# EAGLE schematic H19R00 (EAGLE 9.6.2)

## Sheet 1 of 3: I/O parts
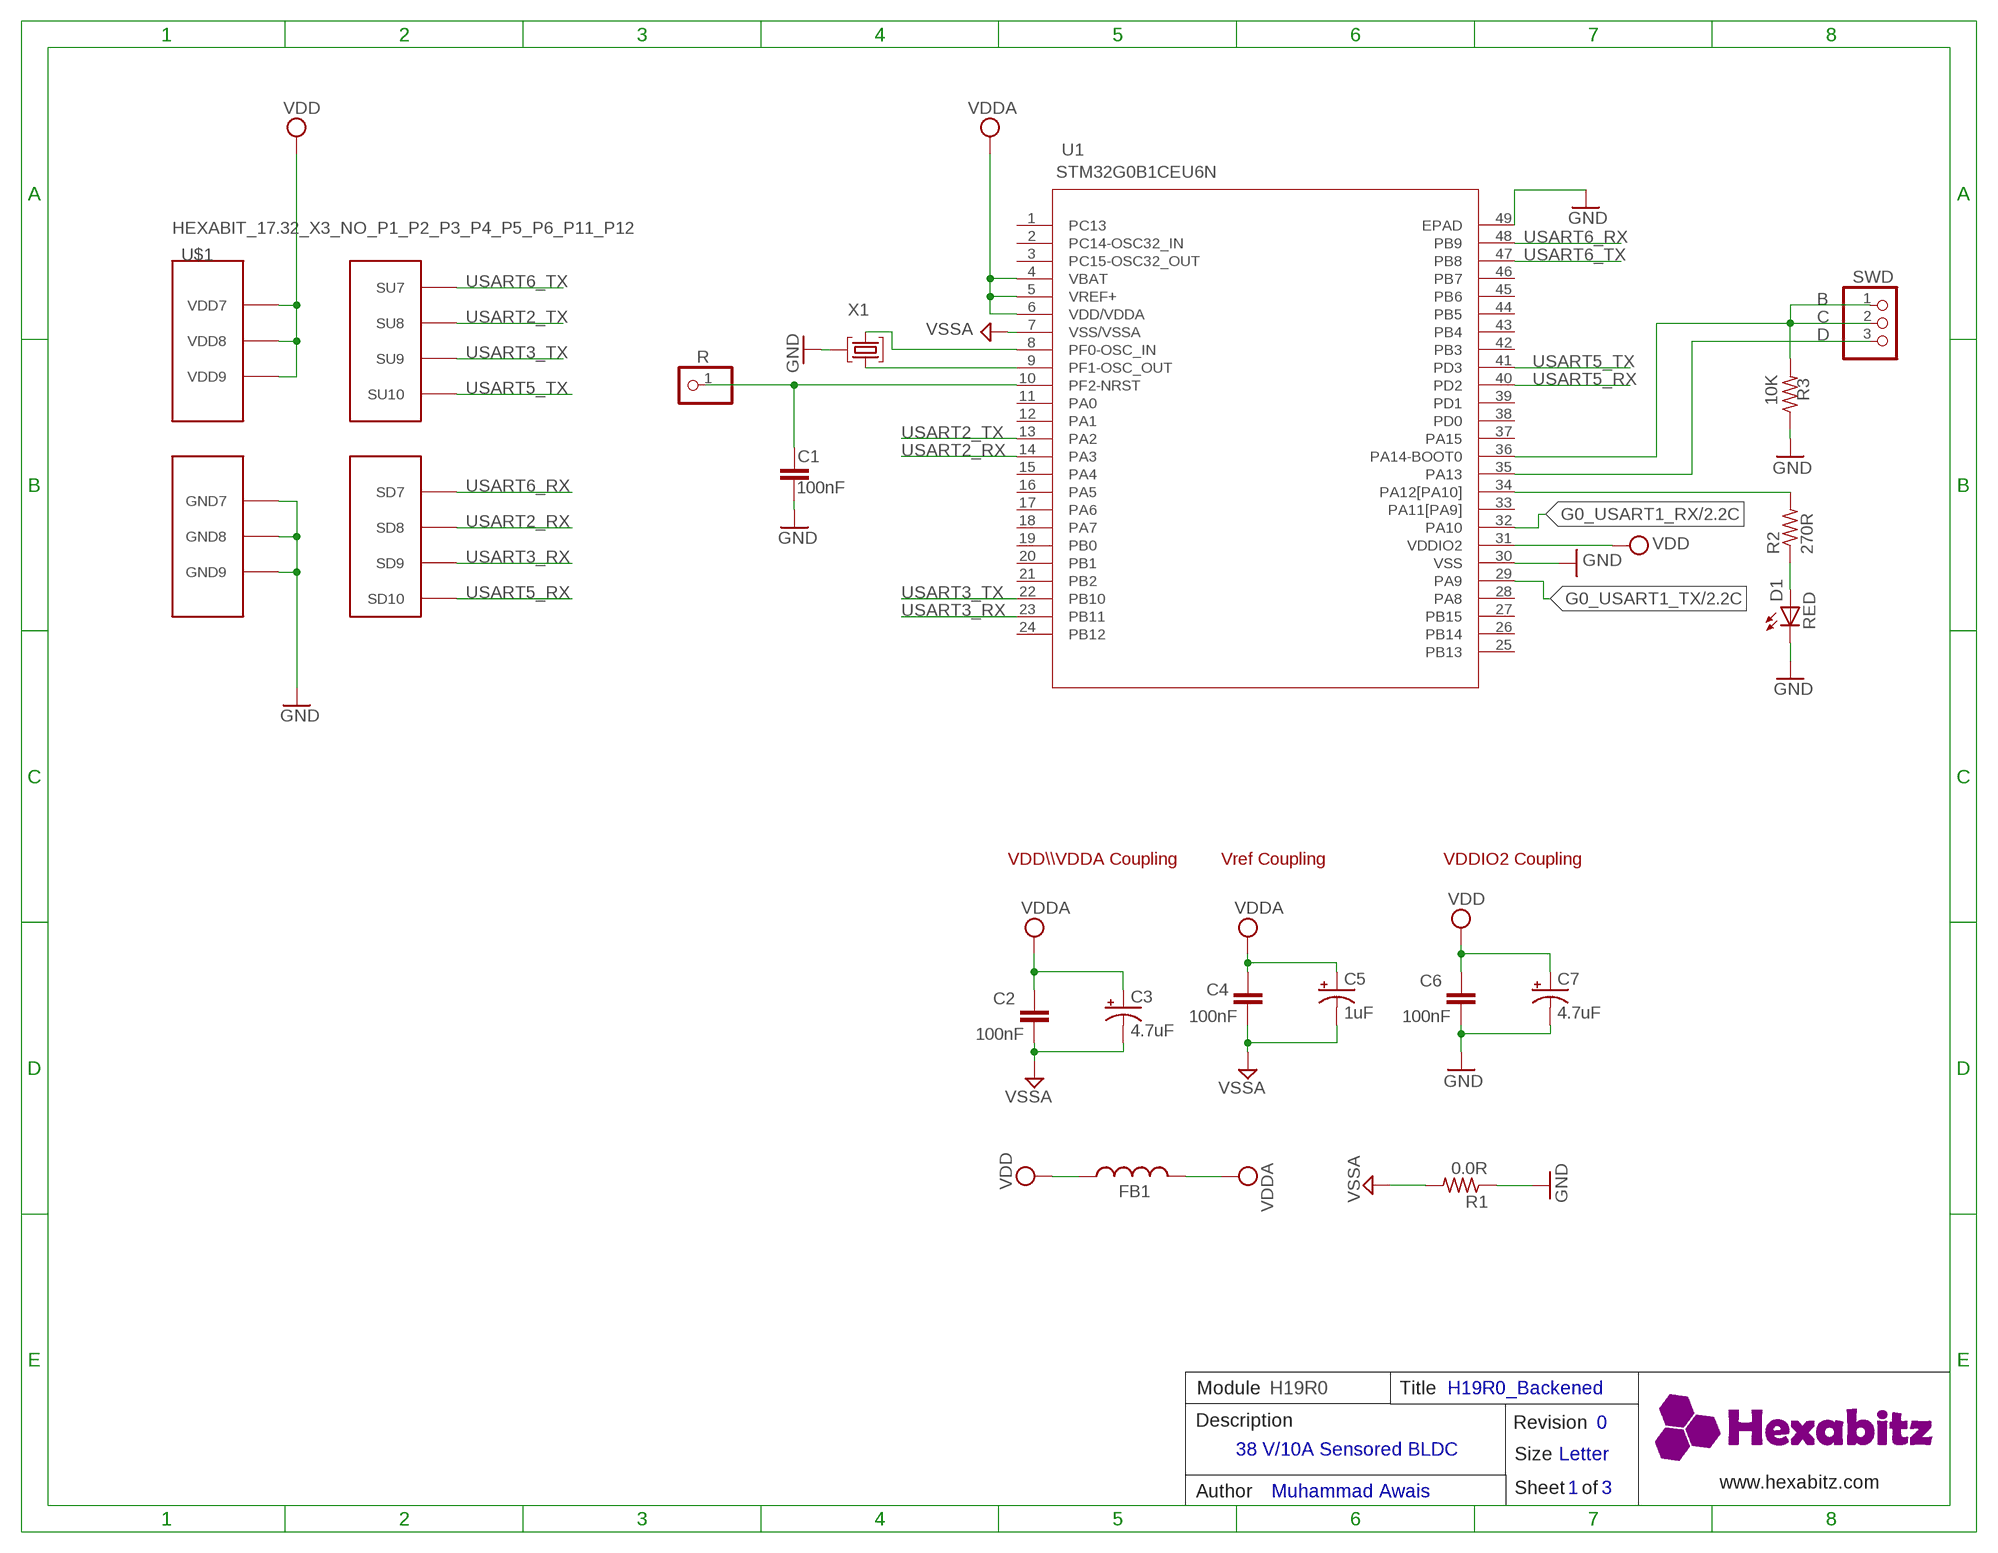
[diagram p0: schematic, sheet 1]

### Parts
C1  100nF  C-0603  [C-0603]
C2  100nF  C-0603  [C-0603]
C3  4.7uF  C-0805-POL  [C-0805-POL]
C4  100nF  C-0603  [C-0603]
C5  1uF  C-0805-POL  [C-0805-POL]
C6  100nF  C-0603  [C-0603]
C7  4.7uF  C-0805-POL  [C-0805-POL]
D1  RED  VLMS1300-GS08  [VLMS1300-GS08]
FB1  FB-TDK_MMZ1608Y300B  [FB-TDK_MMZ1608Y300B]
R  PINHD-1X1  [1X01]
R1  0.0R  R-0603  [R-0603]
R2  270R  R-0603  [R-0603]
R3  10K  R-0603  [R-0603]
SWD  PINHD-1X3  [1X03]
U1  STM32G0B1CEU6N  [HEXABITZ_ICS_QFN_B1CEU6_STM-L]
U$1  HEXABIT_17.32_X3_NO_P1_P2_P3_P4_P5_P6_P11_P12  [HEXABIT_17.32_X3_NO_P1_P2_P3_P4_P5_P6_P11_P12]
X1  8MHZ  XTALL_CSTCE8M00G52  [XTALL_CSTCE8M00G52]

### Nets
C: R3.2 SWD.1 SWD.2 U1.36(PA14-BOOT0)
D: SWD.3 U1.35(PA13)
G0_USART1_RX: U1.32(PA10) ; also sheet 2
G0_USART1_TX: U1.29(PA9) ; also sheet 2
GND: C1.1 C6.1 C7.2(-) D1.C R1.1 R3.1 U1.30(VSS) U1.49(EPAD) U$1.PAD_PD12(GND7) U$1.PAD_PD17(GND8) U$1.PAD_PD19(GND9) X1.P$2
GND1: C2.1 C3.2(-) C4.1 C5.2(-) R1.2 U1.7(VSS/VSSA) ; supply symbol labelled VSSA ; also sheet 2,3
N$1: U1.8(PF0-OSC_IN) X1.P$1
N$2: U1.9(PF1-OSC_OUT) X1.P$3
N$3: R2.2 U1.34(PA12[PA10])
N$4: D1.A R2.1
N$12: C1.2 R.1 U1.10(PF2-NRST)
USART2_RX: U1.14(PA3) U$1.PAD_PD1(SD8)
USART2_TX: U1.13(PA2) U$1.PAD_PU1(SU8)
USART3_RX: U1.23(PB11) U$1.PAD_PD2(SD9)
USART3_TX: U1.22(PB10) U$1.PAD_PU2(SU9)
USART5_RX: U1.40(PD2) U$1.PAD_PD8(SD10)
USART5_TX: U1.41(PD3) U$1.PAD_PU8(SU10)
USART6_RX: U1.48(PB9) U$1.PAD_PD3(SD7)
USART6_TX: U1.47(PB8) U$1.PAD_PU3(SU7)
VDD: C6.2 C7.1(+) FB1.1 U1.31(VDDIO2) U$1.PAD_PU12(VDD7) U$1.PAD_PU17(VDD8) U$1.PAD_PU19(VDD9) ; also sheet 2
VDDA: C2.2 C3.1(+) C4.2 C5.1(+) FB1.2 U1.4(VBAT) U1.5(VREF+) U1.6(VDD/VDDA)
Unconnected: U1.1(PC13) U1.2(PC14-OSC32_IN) U1.3(PC15-OSC32_OUT) U1.11(PA0) U1.12(PA1) U1.15(PA4) U1.16(PA5) U1.17(PA6) U1.18(PA7) U1.19(PB0) U1.20(PB1) U1.21(PB2) U1.24(PB12) U1.25(PB13) U1.26(PB14) U1.27(PB15) U1.28(PA8) U1.33(PA11[PA9]) U1.37(PA15) U1.38(PD0) U1.39(PD1) U1.42(PB3) U1.43(PB4) U1.44(PB5) U1.45(PB6) U1.46(PB7)

### Notes on the sheet
- B
- VDD\\\VDDA Coupling | Vref Coupling | VDDIO2 Coupling
- Module | H19R0 | Title | H19R0_Backened
- Description | Revision | 0
- 38 V/10A Sensored BLDC
- Size | Letter
- www.hexabitz.com
- Author | Muhammad Awais | Sheet   of | 1 | 3

## Sheet 2 of 3
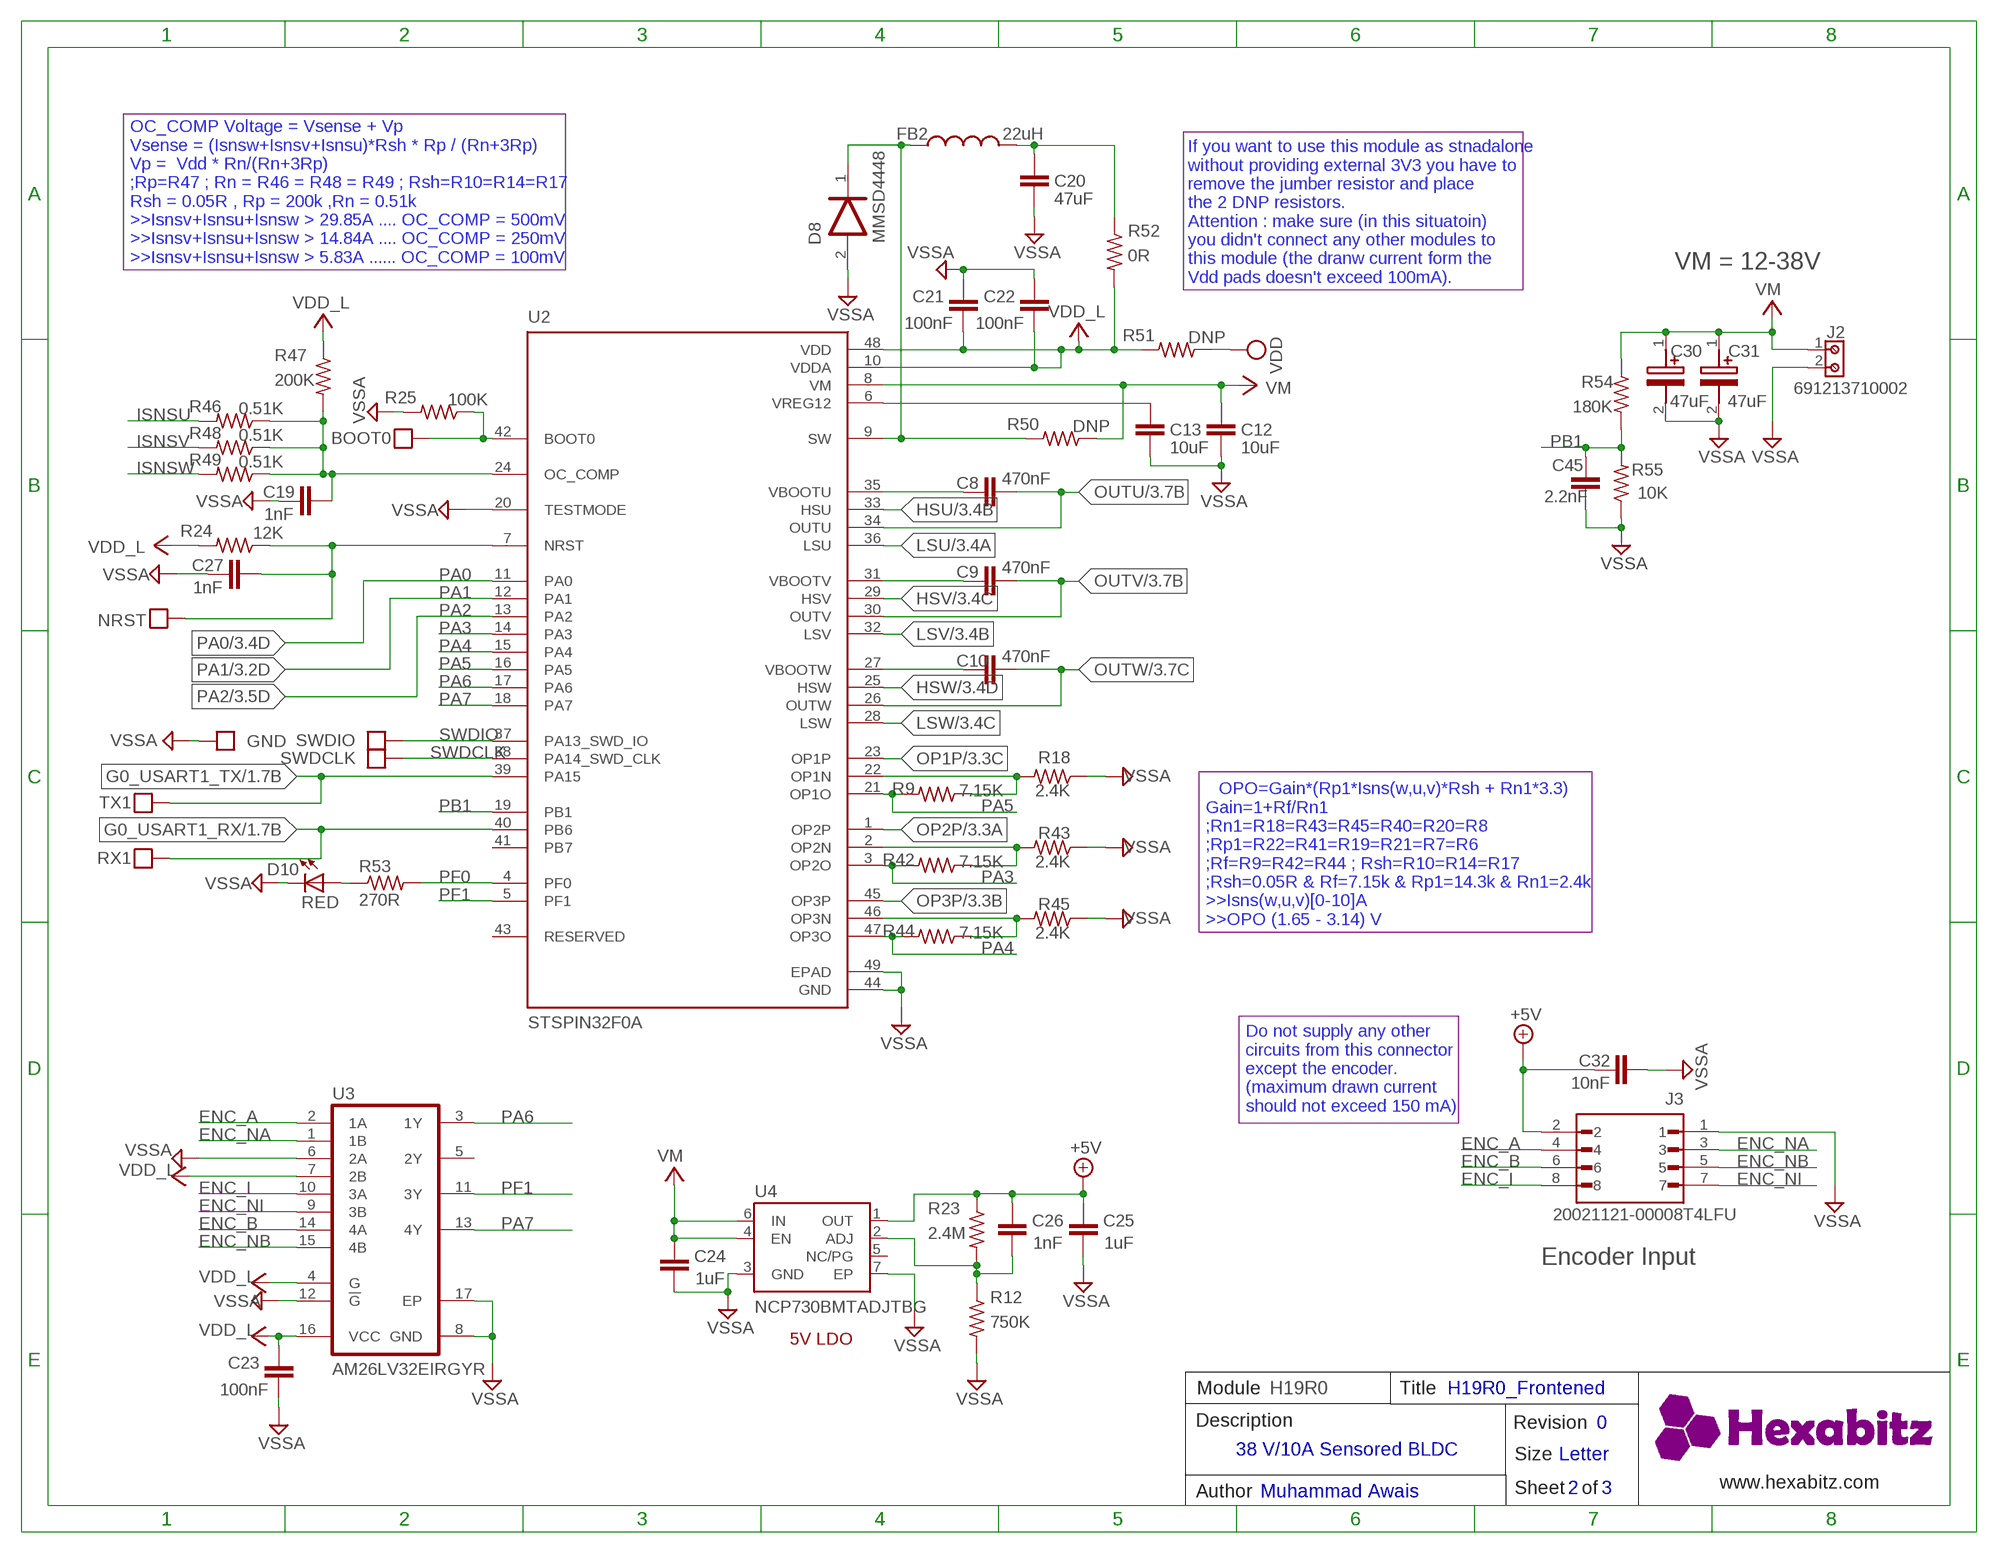
[diagram p1: schematic, sheet 2]

### Parts
BOOT0  PAD4  [PAD4]
C8  470nF  C-0603  [C-0603]
C9  470nF  C-0603  [C-0603]
C10  470nF  C-0603  [C-0603]
C12  10uF  C-0805  [C-0805]
C13  10uF  C-0805  [C-0805]
C19  1nF  C-0603  [C-0603]
C20  47uF  C-0805  [C-0805]
C21  100nF  C-0603  [C-0603]
C22  100nF  C-0603  [C-0603]
C23  100nF  C-0603  [C-0603]
C24  1uF  C-0603  [C-0603]
C25  1uF  C-0603  [C-0603]
C26  1nF  C-0603  [C-0603]
C27  1nF  C-0603  [C-0603]
C30  47uF  UVR1H101MPD1TD  [CAPPRD350W60D825H1300]
C31  47uF  UVR1H101MPD1TD  [CAPPRD350W60D825H1300]
C32  10nF  C-0603  [C-0603]
C45  2.2nF  C-0603  [C-0603]
D8  MMSD4448ONSEMI_MMSD4448_0_0  [ONSEMI_MMSD4448_0]
D10  RED  VLMS1300-GS08  [VLMS1300-GS08]
FB2  22uH  FB-0805  [FB-0805]
GND  PAD4  [PAD4]
J2  691213710002  [691213710002]
J3  20021121-00008T4LFU  [AMPHENOL_20021121-00008T4LF]
NRST  PAD4  [PAD4]
R9  7.15K  R-0603  [R-0603]
R12  750K  R-0603  [R-0603]
R18  2.4K  R-0603  [R-0603]
R23  2.4M  R-0603  [R-0603]
R24  12K  R-0603  [R-0603]
R25  100K  R-0603  [R-0603]
R42  7.15K  R-0603  [R-0603]
R43  2.4K  R-0603  [R-0603]
R44  7.15K  R-0603  [R-0603]
R45  2.4K  R-0603  [R-0603]
R46  0.51K  R-0603  [R-0603]
R47  200K  R-0603  [R-0603]
R48  0.51K  R-0603  [R-0603]
R49  0.51K  R-0603  [R-0603]
R50  DNP  R-0603  [R-0603]
R51  DNP  R-0603  [R-0603]
R52  0R  R-0603  [R-0603]
R53  270R  R-0603  [R-0603]
R54  180K  R-0603  [R-0603]
R55  10K  R-0603  [R-0603]
RX1  PAD4  [PAD4]
SWDCLK  PAD4  [PAD4]
SWDIO  PAD4  [PAD4]
TX1  PAD4  [PAD4]
U2  STSPIN32F0A  [IC_STSPIN32F0A]
U3  AM26LV32EIRGYRTEXAS_INSTRUMENTS_AM26LV32EIRGYR_0_0  [TEXAS_INSTRUMENTS_AM26LV32EIRGYR_0]
U4  NCP730BMTADJTBGON_SEMI_NCP730BMTADJTBG_0_0  [ON_SEMI_NCP730BMTADJTBG_0]

### Nets
+5V: C25.2 C26.2 C32.1 J3.2 R23.1 U4.1(OUT) ; also sheet 3
ENC_A: J3.4 U3.2(1A)
ENC_B: J3.6 U3.14(4A)
ENC_I: J3.8 U3.10(3A)
ENC_NA: J3.3 U3.1(1B)
ENC_NB: J3.5 U3.15(4B)
ENC_NI: J3.7 U3.9(3B)
G0_USART1_RX: RX1.P$1 U2.40(PB6) ; also sheet 1
G0_USART1_TX: TX1.P$1 U2.39(PA15) ; also sheet 1
GND1: C12.2 C13.2 C19.1 C20.2 C21.2 C22.2 C23.1 C24.1 C25.1 C27.1 C30.2(-) C31.2(-) C32.2 C45.1 D8.2(ANODE) D10.C GND.P$1 J2.2 J3.1 R12.2 R18.1 R25.2 R43.1 R45.1 R55.1 U2.20(TESTMODE) U2.44(GND) U2.49(EPAD) U3.8(GND) U3.12(!G!) U3.17(EP) U4.3(GND) U4.7(EP) ; supply symbol labelled VSSA ; also sheet 1,3
HSU: U2.33(HSU) ; also sheet 3
HSV: U2.29(HSV) ; also sheet 3
HSW: U2.25(HSW) ; also sheet 3
ISNSU: R46.2 ; also sheet 3
ISNSV: R48.2 ; also sheet 3
ISNSW: R49.2 ; also sheet 3
LSU: U2.36(LSU) ; also sheet 3
LSV: U2.32(LSV) ; also sheet 3
LSW: U2.28(LSW) ; also sheet 3
N$5: R42.1 R43.2 U2.2(OP2N)
N$6: C8.2 U2.35(VBOOTU)
N$7: C9.2 U2.31(VBOOTV)
N$8: C10.2 U2.27(VBOOTW)
N$11: C26.1 R12.1 R23.2 U4.2(ADJ)
N$14: C27.2 NRST.P$1 R24.1 U2.7(NRST)
N$15: C13.1 U2.6(VREG12)
N$17: BOOT0.P$1 R25.1 U2.42(BOOT0)
N$18: U3.6(2A) ; supply symbol labelled VSSA
N$29: R9.1 R18.2 U2.22(OP1N)
N$30: R44.1 R45.2 U2.46(OP3N)
N$31: C19.2 R46.1 R47.2 R48.1 R49.1 U2.24(OC_COMP)
N$32: D10.A R53.1
N$33: D8.1(CATHODE) FB2.1 R50.2 U2.9(SW)
N$34: C20.1 FB2.2 R52.1
OP1P: U2.23(OP1P) ; also sheet 3
OP2P: U2.1(OP2P) ; also sheet 3
OP3P: U2.45(OP3P) ; also sheet 3
OUTU: C8.1 U2.34(OUTU) ; also sheet 3
OUTV: C9.1 U2.30(OUTV) ; also sheet 3
OUTW: C10.1 U2.26(OUTW) ; also sheet 3
PA0: U2.11(PA0) ; also sheet 3
PA1: U2.12(PA1) ; also sheet 3
PA2: U2.13(PA2) ; also sheet 3
PA3: R42.2 U2.3(OP2O) U2.14(PA3)
PA4: R44.2 U2.15(PA4) U2.47(OP3O)
PA5: R9.2 U2.16(PA5) U2.21(OP1O)
PA6: U2.17(PA6) U3.3(1Y)
PA7: U2.18(PA7) U3.13(4Y)
PB1: C45.2 R54.2 R55.2 U2.19(PB1)
PF0: R53.2 U2.4(PF0)
PF1: U2.5(PF1) U3.11(3Y)
SWDCLK: SWDCLK.P$1 U2.38(PA14_SWD_CLK)
SWDIO: SWDIO.P$1 U2.37(PA13_SWD_IO)
VDD: R51.1 ; also sheet 1
VDD_L: C21.1 C22.1 C23.2 R24.2 R47.1 R51.2 R52.2 U2.10(VDDA) U2.48(VDD) U3.4(G) U3.7(2B) U3.16(VCC) ; also sheet 3
VM: C12.1 C24.2 C30.1(+) C31.1(+) J2.1 R50.1 R54.1 U2.8(VM) U4.4(EN) U4.6(IN) ; also sheet 3
Unconnected: U2.41(PB7) U2.43(RESERVED) U3.5(2Y) U4.5(NC/PG)

### Notes on the sheet
- OC_COMP Voltage = Vsense + Vp
  Vsense = (Isnsw+Isnsv+Isnsu)*Rsh * Rp / (Rn+3Rp) 
  Vp =  Vdd * Rn/(Rn+3Rp)
  ;Rp=R47 ; Rn = R46 = R48 = R49 ; Rsh=R10=R14=R17
  Rsh = 0.05R , Rp = 200k ,Rn = 0.51k
  >>Isnsv+Isnsu+Isnsw > 29.85A .... OC_COMP = 500mV
  >>Isnsv+Isnsu+Isnsw > 14.84A .... OC_COMP = 250mV
  >>Isnsv+Isnsu+Isnsw > 5.83A ...... OC_COMP = 100mV
- VM = 12-38V
- If you want to use this module as stnadalone
  without providing external 3V3 you have to
  remove the jumber resistor and place
  the 2 DNP resistors.
  Attention : make sure (in this situatoin)
  you didn't connect any other modules to
  this module (the dranw current form the
  Vdd pads doesn't exceed 100mA).
- ￼OPO=Gain*(Rp1*Isns(w,u,v)*Rsh + Rn1*3.3)
  Gain=1+Rf/Rn1
  ;Rn1=R18=R43=R45=R40=R20=R8
  ;Rp1=R22=R41=R19=R21=R7=R6
  ;Rf=R9=R42=R44 ; Rsh=R10=R14=R17
  ;Rsh=0.05R & Rf=7.15k & Rp1=14.3k & Rn1=2.4k
  >>Isns(w,u,v)[0-10]A 
  >>OPO (1.65 - 3.14) V
- Do not supply any other
  circuits from this connector
  except the encoder.
  (maximum drawn current
  should not exceed 150 mA)
- Encoder Input
- 5V LDO
- Module | H19R0 | Title | H19R0_Frontened
- Description | Revision | 0
- 38 V/10A Sensored BLDC
- Size | Letter
- www.hexabitz.com
- Author | Muhammad Awais | Sheet   of | 2 | 3

## Sheet 3 of 3
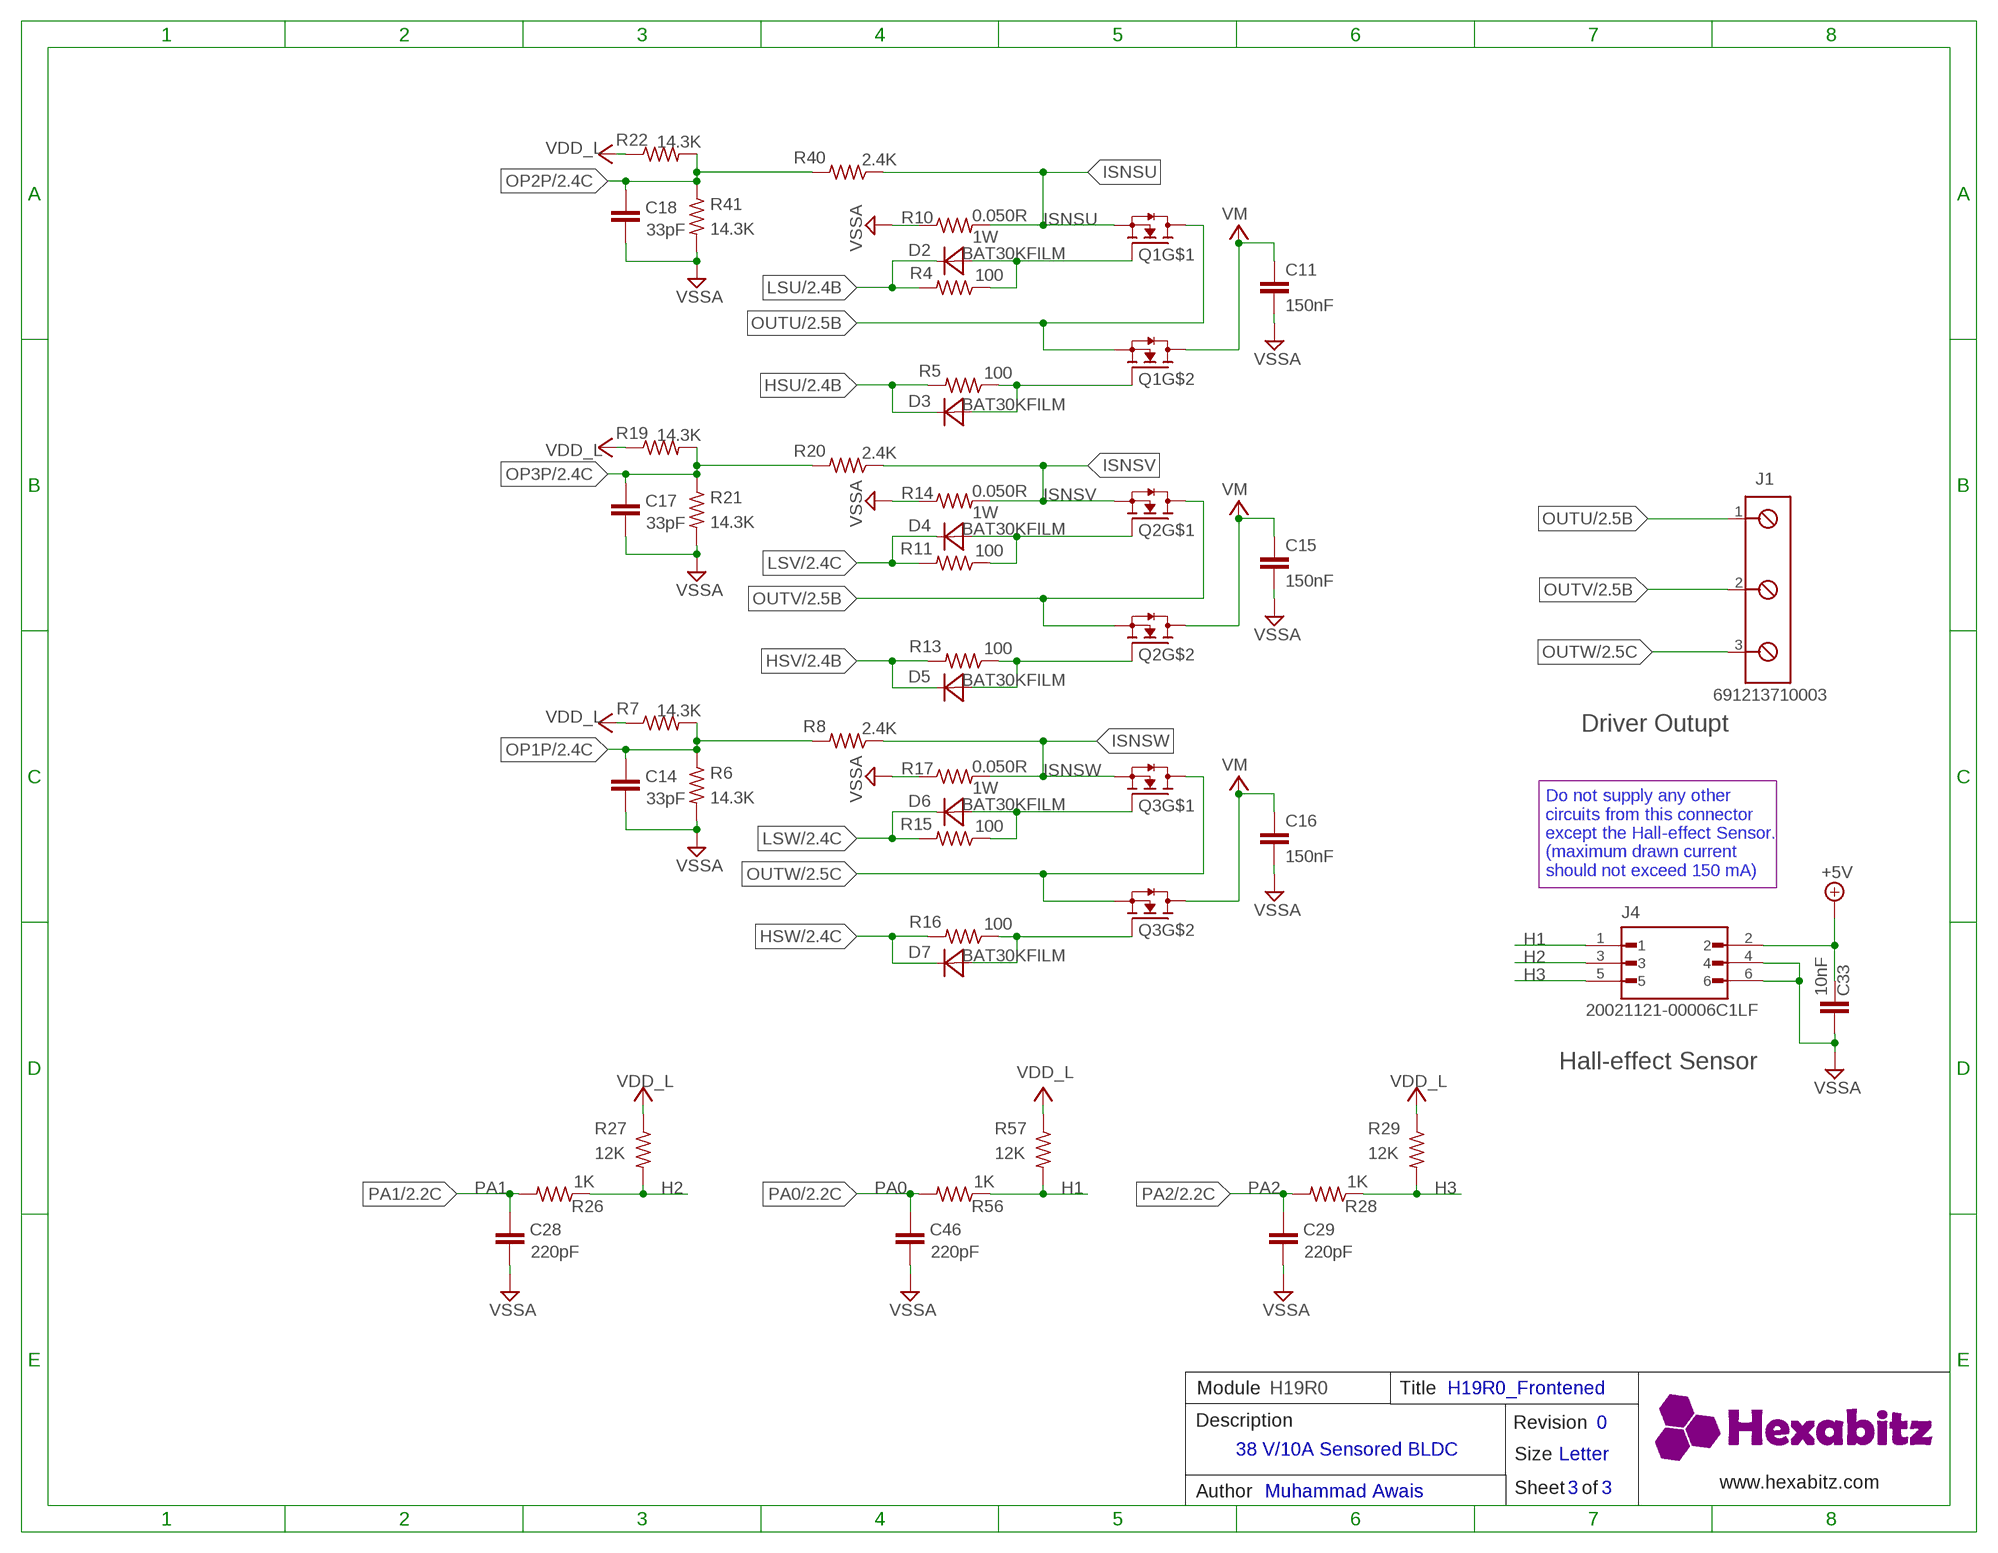
[diagram p2: schematic, sheet 3]

### Parts
C11  150nF  C-0805  [C-0805]
C14  33pF  C-0603  [C-0603]
C15  150nF  C-0805  [C-0805]
C16  150nF  C-0805  [C-0805]
C17  33pF  C-0603  [C-0603]
C18  33pF  C-0603  [C-0603]
C28  220pF  C-0603  [C-0603]
C29  220pF  C-0603  [C-0603]
C33  10nF  C-0603  [C-0603]
C46  220pF  C-0603  [C-0603]
D2  BAT30KFILM  [STMICROELECTRONICS_BAT30KFILM_0]
D3  BAT30KFILM  [STMICROELECTRONICS_BAT30KFILM_0]
D4  BAT30KFILM  [STMICROELECTRONICS_BAT30KFILM_0]
D5  BAT30KFILM  [STMICROELECTRONICS_BAT30KFILM_0]
D6  BAT30KFILM  [STMICROELECTRONICS_BAT30KFILM_0]
D7  BAT30KFILM  [STMICROELECTRONICS_BAT30KFILM_0]
J1  691213710003  691213710003  [691213710003]
J4  20021121-00006C1LF  [AMPHENOL_20021121-00006C1LF]
Q1  PJQ5866A_R2_00001  [PJQ5866A_R2_00001-8-POWERTDFN]
Q2  PJQ5866A_R2_00001  [PJQ5866A_R2_00001-8-POWERTDFN]
Q3  PJQ5866A_R2_00001  [PJQ5866A_R2_00001-8-POWERTDFN]
R4  100  R-0603  [R-0603]
R5  100  R-0603  [R-0603]
R6  14.3K  R-0603  [R-0603]
R7  14.3K  R-0603  [R-0603]
R8  2.4K  R-0603  [R-0603]
R10  0.050R  R_1206R1206  [R1206]
R11  100  R-0603  [R-0603]
R13  100  R-0603  [R-0603]
R14  0.050R  R_1206R1206  [R1206]
R15  100  R-0603  [R-0603]
R16  100  R-0603  [R-0603]
R17  0.050R  R_1206R1206  [R1206]
R19  14.3K  R-0603  [R-0603]
R20  2.4K  R-0603  [R-0603]
R21  14.3K  R-0603  [R-0603]
R22  14.3K  R-0603  [R-0603]
R26  1K  R-0603  [R-0603]
R27  12K  R-0603  [R-0603]
R28  1K  R-0603  [R-0603]
R29  12K  R-0603  [R-0603]
R40  2.4K  R-0603  [R-0603]
R41  14.3K  R-0603  [R-0603]
R56  1K  R-0603  [R-0603]
R57  12K  R-0603  [R-0603]

### Nets
+5V: C33.1 J4.2 ; also sheet 2
GND1: C11.2 C14.1 C15.2 C16.2 C17.1 C18.1 C28.1 C29.1 C33.2 C46.1 J4.4 J4.6 R6.2 R10.1 R14.1 R17.1 R21.2 R41.2 ; supply symbol labelled VSSA ; also sheet 1,2
H1: J4.1 R56.1 R57.2
H2: J4.3 R26.1 R27.2
H3: J4.5 R28.1 R29.2
HSU: D3.C R5.2 ; also sheet 2
HSV: D5.C R13.2 ; also sheet 2
HSW: D7.C R16.2 ; also sheet 2
ISNSU: Q1.1(S1) R10.2 R40.1 ; also sheet 2
ISNSV: Q2.1(S1) R14.2 R20.1 ; also sheet 2
ISNSW: Q3.1(S1) R8.1 R17.2 ; also sheet 2
LSU: D2.C R4.2 ; also sheet 2
LSV: D4.C R11.2 ; also sheet 2
LSW: D6.C R15.2 ; also sheet 2
N$9: D2.A Q1.2(G1) R4.1
N$10: D4.A Q2.2(G1) R11.1
N$13: D3.A Q1.4(G2) R5.1
N$16: D5.A Q2.4(G2) R13.1
N$26: D6.A Q3.2(G1) R15.1
N$27: D7.A Q3.4(G2) R16.1
OP1P: C14.2 R6.1 R7.2 R8.2 ; also sheet 2
OP2P: C18.2 R22.2 R40.2 R41.1 ; also sheet 2
OP3P: C17.2 R19.2 R20.2 R21.1 ; also sheet 2
OUTU: J1.1 Q1.3(S2) Q1.7_8(D1) ; also sheet 2
OUTV: J1.2 Q2.3(S2) Q2.7_8(D1) ; also sheet 2
OUTW: J1.3 Q3.3(S2) Q3.7_8(D1) ; also sheet 2
PA0: C46.2 R56.2 ; also sheet 2
PA1: C28.2 R26.2 ; also sheet 2
PA2: C29.2 R28.2 ; also sheet 2
VDD_L: R7.1 R19.1 R22.1 R27.1 R29.1 R57.1 ; also sheet 2
VM: C11.1 C15.1 C16.1 Q1.5_6(D2) Q2.5_6(D2) Q3.5_6(D2) ; also sheet 2

### Notes on the sheet
- Driver Outupt
- Do not supply any other
  circuits from this connector
  except the Hall-effect Sensor.
  (maximum drawn current
  should not exceed 150 mA)
- Hall-effect Sensor
- Module | H19R0 | Title | H19R0_Frontened
- Description | Revision | 0
- 38 V/10A Sensored BLDC
- Size | Letter
- www.hexabitz.com
- Author | Muhammad Awais | Sheet   of | 3 | 3

## Library data of the parts
BOOT0 GND NRST RX1 SWDCLK SWDIO TX1 = HEXABITZ_CONNECTION_PARTS:PAD4
C1 = HEXABITZ_RCLS:C-0603: CAP CER 10% X7R 0603; CAPACITANCE: 100nF; MFN: AVX CORPORATION; MPN: 0603YC104K4T2A; OCTOPART_URL: 'https://octopart.com/0603yc104k4t2a-avx+interconnect+%2F+elco-8120651; TOLERANCE: 10%; VOLTAGE_RATING: 16.0 V
C2 C4 C6 C21-C23 = HEXABITZ_RCLS:C-0603: CAP CER 10% X7R 0603; CAPACITANCE: 100nF; MFN: AVX CORPORATION; MPN: '0603YC104K4T2A; OCTOPART_URL: 'https://octopart.com/0603yc104k4t2a-avx+interconnect+%2F+elco-8120651; TOLERANCE: 10%; VOLTAGE_RATING: 16.0 V
C3 = HEXABITZ_RCLS:C-0805-POL: Cap Tant Solid SMD 2012; CAPACITANCE: 4.7uF; MFN: 'Panasonic; MPN: '10TPU4R7MSI; OCTOPART_URL: https://octopart.com/10tpu4r7msi-panasonic-29487748?r=sp; TOLERANCE: 20%; VOLTAGE_RATING: 10.0 V
C5 = HEXABITZ_RCLS:C-0805-POL: Cap Tant Solid SMD 2012; CAPACITANCE: 4.7uF; MFN: 'YAGEO [VA]; MPN: 'CC0805KKX7R7BB105; OCTOPART_URL: 'https://octopart.com/cc0805kkx7r7bb105-yageo-8376555?r=sp; TOLERANCE: 20%; VOLTAGE_RATING: 10.0 V
C7 = HEXABITZ_RCLS:C-0805-POL: Cap Tant Solid SMD 2012; CAPACITANCE: 1.00uF; MFN: 'Panasonic; MPN: '10TPU4R7MSI; OCTOPART_URL: https://octopart.com/10tpu4r7msi-panasonic-29487748?r=sp; TOLERANCE: 10%; VOLTAGE_RATING: 16.0 V
C8-C10 = HEXABITZ_RCLS:C-0603: CAP CER 10% X7R 0603; CAPACITANCE: 470nF; MFN: TDK Corporation; MPN: C1608X5R1H474K080AB; OCTOPART_URL: https://octopart.com/search?q=C1608X5R1H474K080AB&currency=USD&specs=0; TOLERANCE: 10%; VOLTAGE_RATING: 50V
C11 C15 C16 = HEXABITZ_RCLS:C-0805: CAP CER 10% X7R 0805; CAPACITANCE: 150nF; MFN: KEMET; MPN: C0805C154K1REC7800; OCTOPART_URL: https://octopart.com/search?q=C0805C154K1REC7800&currency=USD&specs=0; TOLERANCE: 10%; VOLTAGE_RATING: 100V
C12 C13 = HEXABITZ_RCLS:C-0805: CAP CER 10% X7R 0805; CAPACITANCE: 10uF; MFN: Murata Electronics; MPN: GRM21BR61H106KE43K; OCTOPART_URL: https://octopart.com/search?q=GRM21BR61H106KE43K&currency=USD&specs=0; TOLERANCE: 10%; VOLTAGE_RATING: 50V
C14 C17 C18 = HEXABITZ_RCLS:C-0603: CAP CER 10% X7R 0603; CAPACITANCE: 33pF; MFN: Walsin Technology Corporation; MPN: 0603N330J500CT; OCTOPART_URL: https://octopart.com/search?q=0603N330J500CT&currency=USD&specs=0; TOLERANCE: 10%; VOLTAGE_RATING: 50V
C19 C26 C27 = HEXABITZ_RCLS:C-0603: CAP CER 10% X7R 0603; CAPACITANCE: 1nF; MFN: YAGEO; MPN: CC0603KRNPO9BN102; OCTOPART_URL: https://octopart.com/search?q=CC0603KRNPO9BN102&currency=USD&specs=0; TOLERANCE: 10%; VOLTAGE_RATING: 50V
C20 = HEXABITZ_RCLS:C-0805: CAP CER 10% X7R 0805; CAPACITANCE: 47uF; MFN: Murata Electronics; MPN: GRM21BR61A476ME15K; OCTOPART_URL: https://octopart.com/search?q=GRM21BR61A476ME15K&currency=USD&specs=0; TOLERANCE: 20%; VOLTAGE_RATING: 10V
C24 C25 = HEXABITZ_RCLS:C-0603: CAP CER 10% X7R 0603; CAPACITANCE: 1uF; MFN: Taiyo Yuden; MPN: UMK107BJ105KA-T; OCTOPART_URL: https://octopart.com/search?q=UMK107BJ105KA-T&currency=USD&specs=0; TOLERANCE: 10%; VOLTAGE_RATING: 50V
C28 C29 C46 = HEXABITZ_RCLS:C-0603: CAP CER 10% X7R 0603; CAPACITANCE: 220pF; MFN: Walsin Technology Corporation; MPN: 0603B221K500CT; OCTOPART_URL: https://octopart.com/search?q=0603B221K500CT&currency=USD&specs=0; TOLERANCE: 10%; VOLTAGE_RATING: 50V
C30 C31 = HEXABITZ_RCLS:UVR1H101MPD1TD: Nichicon 100uF Electrolytic Capacitor 50V dc, Through Hole - UVR1H101MPD1TD Source: Datasheet <http://nichicon-us.com/english/products/pdfs/e-uvr.pdf>; DESCRIPTION: Nichicon 100uF Electrolytic Capacitor 50V dc, Through Hole - UVR1H101MPD1TD; HEIGHT: 13mm; MANUFACTURER_NAME: Nichicon; MANUFACTURER_PART_NUMBER: UVR1H101MPD1TD; MOUSER_PART_NUMBER: 647-UVR1H101MPD1TD; MOUSER_PRICE-STOCK: https://www.mouser.co.uk/ProductDetail/Nichicon/UVR1H101MPD1TD?qs=%2FDE72MuqLHN1tB2p53VuzA%3D%3D
C32 C33 = HEXABITZ_RCLS:C-0603: CAP CER 10% X7R 0603; CAPACITANCE: 10nF; MFN: KEMET; MPN: C0603X103K1RAC3316; OCTOPART_URL: https://octopart.com/search?q=C0603X103K1RAC3316&currency=USD&specs=0; TOLERANCE: 10%; VOLTAGE_RATING: 100V
C45 = HEXABITZ_RCLS:C-0603: CAP CER 10% X7R 0603; CAPACITANCE: 2nF; MFN: KEMET; MPN: C0603C222K4RECAUTO; OCTOPART_URL: https://octopart.com/search?q=C0603C222K4RECAUTO&currency=USD&specs=0; TOLERANCE: 10%; VOLTAGE_RATING: 16V
D1 D10 = HEXABITZ_USER_INTERFACE_PARTS:VLMS1300-GS08: Red 0603 130° Clear 54 mcd 2 V Surface Mount ChipLED ; Octopart Url : http://octopart.com/vlms1300-gs08-vishay-21709201; MFN: Vishay; MPN: VLMS1300-GS08; OCTOPART_URL: https://octopart.com/vlms1300-gs08-vishay-21709201?r=sp&s=0nXJNjGsSbWwqfqWlZv0EA
D2-D7 = HEXABITZ_RCLS:BAT30KFILM: Diode 30 V 300mA Surface Mount SOD-523; DESCRIPTION: DIODE SCHOTTKY 30V 300MA SOD523; MFN: STMicroelectronics; MPN: BAT30KFILM; OCTOPART_URL: https://octopart.com/bat30kfilm-stmicroelectronics-658191?r=sp
D8 = HEXABITZ_RCLS:MMSD4448: Diode 100 V 200mA Surface Mount SOD-123; DIGIKEY_DESCRIPTION: DIODE GEN PURP 100V 200MA SOD123; MNF: onsemi; MPN: MMSD4448; OCTOPART_URL: https://octopart.com/mmsd4448-onsemi-84330297?r=spc#CadModels
FB1 = HEXABITZ_RCLS:FB-TDK_MMZ1608Y300B: Ferrite Beads Multi-Layer 30Ohm 25% 100MHz 1.5A 50mOhm DCR 0603; MFN: TDK; MPN: MMZ1608Y300BTA00; OCTOPART_URL: https://octopart.com/mmz1608y300bta00-tdk-7906990?r=sp
FB2 = HEXABITZ_RCLS:FB-0805: Ferrite Beads Multi-Layer 0805; MFN: TDK Corporation; MPN: MLZ2012P220WT000; OCTOPART_URL: https://octopart.com/search?q=MLZ2012P220WT000&currency=USD&specs=0
J1 = HEXABITZ_CONNECTION_PARTS:691213710003: TERM BLK 3POS SIDE ENTRY 5MM PCB; DESCRIPTION: TERM BLK 3POS SIDE ENTRY 5MM PCB; MNF: Wurth Elektronik; MPN: 691213710003; OCTOPART_URL: https://octopart.com/search?q=691213710003&currency=USD&specs=0; PITCH: 5mm; WIRE: 26 to 16 (AWG) 0.129 to 1.31 (mm²); WORKING-VOLTAGE-UL: 300V (AC); WORKING-VOLTAGE-VDE: 250V (AC)
J2 = HEXABITZ_CONNECTION_PARTS:691213710002: TERM BLK 2POS SIDE ENTRY 5MM PCB; DESCRIPTION: TERM BLK 2POS SIDE ENTRY 5MM PCB; MNF: Würth Elektronik; MPN: 691213710002; OCTOPART_URL: https://octopart.com/search?q=691213710002&currency=USD&specs=0
J3 = HEXABITZ_CONNECTION_PARTS:20021121-00008T4LF: CONN HEADER SMD 8POS 1.27MM; DESCRIPTION: CONN HEADER SMD 8POS 1.27MM; MNF: Amphenol ICC (FCI); MPN: 20021121-00008T4LF; OCTOPART_URL: https://octopart.com/search?q=20021121-00008T4LF&currency=USD&specs=0
J4 = HEXABITZ_CONNECTION_PARTS:20021121-00006C1LF: CONN HEADER SMD 6POS 1.27MM; DESCRIPTION: CONN HEADER SMD 6POS 1.27MM; MNF: Amphenol; MPN: 20021121-00006C1LF; OCTOPART_URL: https://www.digikey.com/en/products/detail/amphenol-cs-fci/20021121-00006C1LF/4570196?s=N4IgTCBcDa4AxzARicgtAhA2AxkgNgGYgC6AvkA
Q1-Q3 = HEXABITZ_ICs:PJQ5866A_R2_00001: 60V DUAL N-CHANNEL ENHANCEMENT M; AVAILABILITY: In Stock; DESCRIPTION: 60V, 30A, Dual N-Channel Power MOSFET; MFN: Panjit International Inc.; MPN: PJQ5866A_R2_00001; OCTOPART_URL: https://octopart.com/search?q=PJQ5866A_R2_00001&currency=USD&specs=0; PACKAGE: 8-PowerTDFN; PRICE: 0.87
R = HEXABITZ_USER_INTERFACE_PARTS:PINHD-1X1: PIN HEADER; MFN: TE Connectivity; MPN: 87227-1; OCTOPART_URL: https://octopart.com/87227-1-te+connectivity-39512052?r=sp
R1 = HEXABITZ_RCLS:R-0603: Thick Film Resistors - SMD 0603; MFN: YAGEO [VR]; MPN: RC0603JR-070RL; OCTOPART_URL: https://octopart.com/rc0603jr-070rl-yageo-1241539?r=sp; RESISTANCE: 0R
R2 R53 = HEXABITZ_RCLS:R-0603: Thick Film Resistors - SMD 0603; MFN: 'Panasonic; MPN: 'ERJ-3GEYJ271V; OCTOPART_URL: https://octopart.com/erj-3geyj271v-panasonic-55560546?r=sp; RESISTANCE: 270R
R3 R55 = HEXABITZ_RCLS:R-0603: Thick Film Resistors - SMD 0603; MFN: Vishay; MPN: '060300J0103T5E; OCTOPART_URL: https://octopart.com/search?q=060300J0103T5E&currency=USD&specs=0; RESISTANCE: 10K
R4 R5 R11 R13 R15 R16 = HEXABITZ_RCLS:R-0603: Thick Film Resistors - SMD 0603; MFN: Yageo; MPN: AC0603FR-13100RL; OCTOPART_URL: https://octopart.com/search?q=AC0603FR-13100RL&currency=USD&specs=0; RESISTANCE: 100; TOLERANCE: 1%
R6 R7 R19 R21 R22 R41 = HEXABITZ_RCLS:R-0603: Thick Film Resistors - SMD 0603; MFN: Yageo; MPN: RC0603FR-0721KL; OCTOPART_URL: https://octopart.com/search?q=RC0603FR-0721KL&currency=USD&specs=0; RESISTANCE: 21K; TOLERANCE: 1%
R8 R18 R20 R40 R43 R45 = HEXABITZ_RCLS:R-0603: Thick Film Resistors - SMD 0603; MFN: Yageo; MPN: RC0603FR-132K4L; OCTOPART_URL: https://octopart.com/search?q=RC0603FR-132K4L&currency=USD&specs=0; RESISTANCE: 2.4K; TOLERANCE: 1%
R9 R42 R44 = HEXABITZ_RCLS:R-0603: Thick Film Resistors - SMD 0603; MFN: Yageo; MPN: RC0603FR-0710K5L; OCTOPART_URL: https://octopart.com/search?q=RC0603FR-0710K5L&currency=USD&specs=0; RESISTANCE: 10.5K; TOLERANCE: 1%
R10 R14 R17 = HEXABITZ_RCLS:R_1206: RESISTOR, American symbol; MFN: Panasonic Electronic Components; MPN: ERJ-8BWFR100V; OCTOPART_URL: https://octopart.com/search?q=ERJ-8BWFR100V&currency=USD&specs=0; POWER: 1W; RESISTANCE: 0.100R; TOLERANCE: 1%
R12 = HEXABITZ_RCLS:R-0603: Thick Film Resistors - SMD 0603; MFN: Yageo; MPN: RC0603FR-07750KL; OCTOPART_URL: https://octopart.com/search?q=RC0603FR-07750KL&currency=USD&specs=0; RESISTANCE: 750K; TOLERANCE: 1%
R23 = HEXABITZ_RCLS:R-0603: Thick Film Resistors - SMD 0603; MFN: Yageo; MPN: RC0603FR-072M4L; OCTOPART_URL: https://octopart.com/search?q=RC0603FR-072M4L&currency=USD&specs=0; RESISTANCE: 2.4M; TOLERANCE: 1%
R24 R27 R29 R57 = HEXABITZ_RCLS:R-0603: Thick Film Resistors - SMD 0603; MFN: Yageo; MPN: RC0603FR-0712KL; OCTOPART_URL: https://octopart.com/search?q=RC0603FR-0712KL&currency=USD&specs=0; RESISTANCE: 12K; TOLERANCE: 1%
R25 = HEXABITZ_RCLS:R-0603: Thick Film Resistors - SMD 0603; MFN: Yageo; MPN: RC0603FR-07100KL; OCTOPART_URL: https://octopart.com/search?q=RC0603FR-07100KL&currency=USD&specs=0; RESISTANCE: 100K; TOLERANCE: 1%
R26 R28 R56 = HEXABITZ_RCLS:R-0603: Thick Film Resistors - SMD 0603; MFN: Yageo; MPN: AC0603FR-131KL; OCTOPART_URL: https://octopart.com/search?q=AC0603FR-131KL&currency=USD&specs=0; RESISTANCE: 1K; TOLERANCE: 1%
R46 R48 R49 = HEXABITZ_RCLS:R-0603: Thick Film Resistors - SMD 0603; MFN: Yageo; MPN: RC0603FR-102K2L; OCTOPART_URL: https://octopart.com/search?q=RC0603FR-102K2L&currency=USD&specs=0; RESISTANCE: 2.2K; TOLERANCE: 1%
R47 = HEXABITZ_RCLS:R-0603: Thick Film Resistors - SMD 0603; MFN: Yageo; MPN: RC0603FR-0718KL; OCTOPART_URL: https://octopart.com/search?q=RC0603FR-0718KL&currency=USD&specs=0; RESISTANCE: 18K; TOLERANCE: 1%
R50 R51 = HEXABITZ_RCLS:R-0603: Thick Film Resistors - SMD 0603; MPN: DNP
R52 = HEXABITZ_RCLS:R-0603: Thick Film Resistors - SMD 0603; MFN: YAGEO; MPN: RC0603FR-070RL; OCTOPART_URL: https://octopart.com/search?q=RC0603FR-070RL&currency=USD&specs=0; RESISTANCE: 0R; TOLERANCE: 1%
R54 = HEXABITZ_RCLS:R-0603: Thick Film Resistors - SMD 0603; MFN: Yageo; MPN: RC0603FR-07180KL; OCTOPART_URL: https://octopart.com/search?q=RC0603FR-07180KL&currency=USD&specs=0; RESISTANCE: 180K; TOLERANCE: 1%
SWD = pinhead:PINHD-1X3: PIN HEADER
U1 = HEXABITZ_ICs:STM32G0B1CEU6N
U2 = HEXABITZ_ICs:STSPIN32F0A: Advanced BLDC controller with embedded STM32 MCU; AVAILABILITY: In Stock; DESCRIPTION: Advanced BLDC controller with embedded STM32 MCU; MFN: STMicroelectronics; MPN: STSPIN32F0A; OCTOPART_URL: https://octopart.com/stspin32f0a-stmicroelectronics-87213744?r=sp; PACKAGE: VFQFPN-48 STMicroelectronics; PRICE: 2.37
U3 = HEXABITZ_ICs:AM26LV32EIRGYR: TI-AM26LV32E-VQFN_RGY-16; DESCRIPTION: IC RECEIVER 0/4 16VQFN; MMF: Texas Instruments; MPN: AM26LV32EIRGYR; OCTOPART_URL: https://octopart.com/search?q=AM26LV32EIRGYR&currency=USD&specs=0
U4 = HEXABITZ_ICs:NCP730BMTADJTBG: Linear Voltage Regulator IC Positive Adjustable 1 Output 150mA 6-WDFN (2x2); DATASHEET: https://octopart.com/search?q=NCP730BMTADJTBG&currency=USD&specs=0; DESCRIPTION: LDO Regulator, 150 mA, 38 V, 1 uA IQ, with PG ADJ HZ, WDFN6 2x2; MNF: On Semi; MPN: NCP730BMTADJTBG
U$1 = hexabitz_connectors:HEXABIT_17.32_X3_NO_P1_P2_P3_P4_P5_P6_P11_P12
X1 = HEXABITZ_OTHER_PARTS:XTALL_CSTCE8M00G52: MURATA CSTCE8M00G52-R0 RESONATOR, SMD, 8MHZ ; Octopart Url : https://octopart.com/cstce8m00g52-r0-murata-7145559; MFN: Murata; MPN: CSTNE8M00G550000R0; OCTOPART_URL: https://octopart.com/cstne8m00g550000r0-murata-91406934?r=sp